# Altium schematic sheet SCH_Rx.SchDoc
size A; SheetNumber: 2; SheetTotal: 2
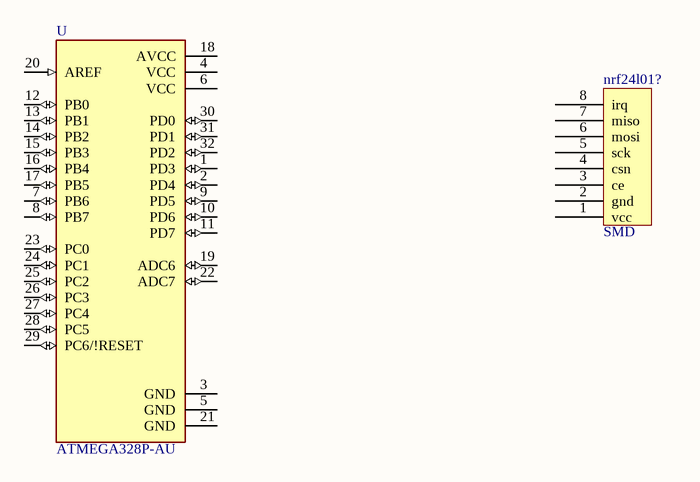
[diagram p0: SCH_Rx.SchDoc]

## Parts
nrf24l01?  SMD  [NRF24L01]
U  ATMEGA328P-AU  [QFP80P900X900X120-32N]

## Nets

Not connected (* = marked no-connect by the designer): nrf24l01? 1(vcc) 2(gnd) 3(ce) 4(csn) 5(sck) 6(mosi) 7(miso) 8(irq); U 1(PD3) 2(PD4) 3(GND) 4(VCC) 5(GND) 6(VCC) 7(PB6) 8(PB7) 9(PD5) 10(PD6) 11(PD7) 12(PB0) 13(PB1) 14(PB2) 15(PB3) 16(PB4) 17(PB5) 18(AVCC) 19(ADC6) 20(AREF) 21(GND) 22(ADC7) 23(PC0) 24(PC1) 25(PC2) 26(PC3) 27(PC4) 28(PC5) 29(PC6/!RESET) 30(PD0) 31(PD1) 32(PD2)

## Library data of the parts
nrf24l01? = nrf24l01_smd
U = ATMEGA328P-AU: AVR AVRÂ® ATmega Microcontroller IC 8-Bit 20MHz 32KB _16K x 16_ FLASH 32-TQFP _7x7_; MF: Microchip; Value: *; SnapEDA_Link: https://www.snapeda.com/parts/ATMEGA328P-AU/Microchip/view-part/44280/?ref=snap; MP: ATMEGA328P-AU; Availability: Unavailable; Price: None; Package: TQFP-32 Microchip